# Altium schematic sheet TB6000.SchDoc
size A3
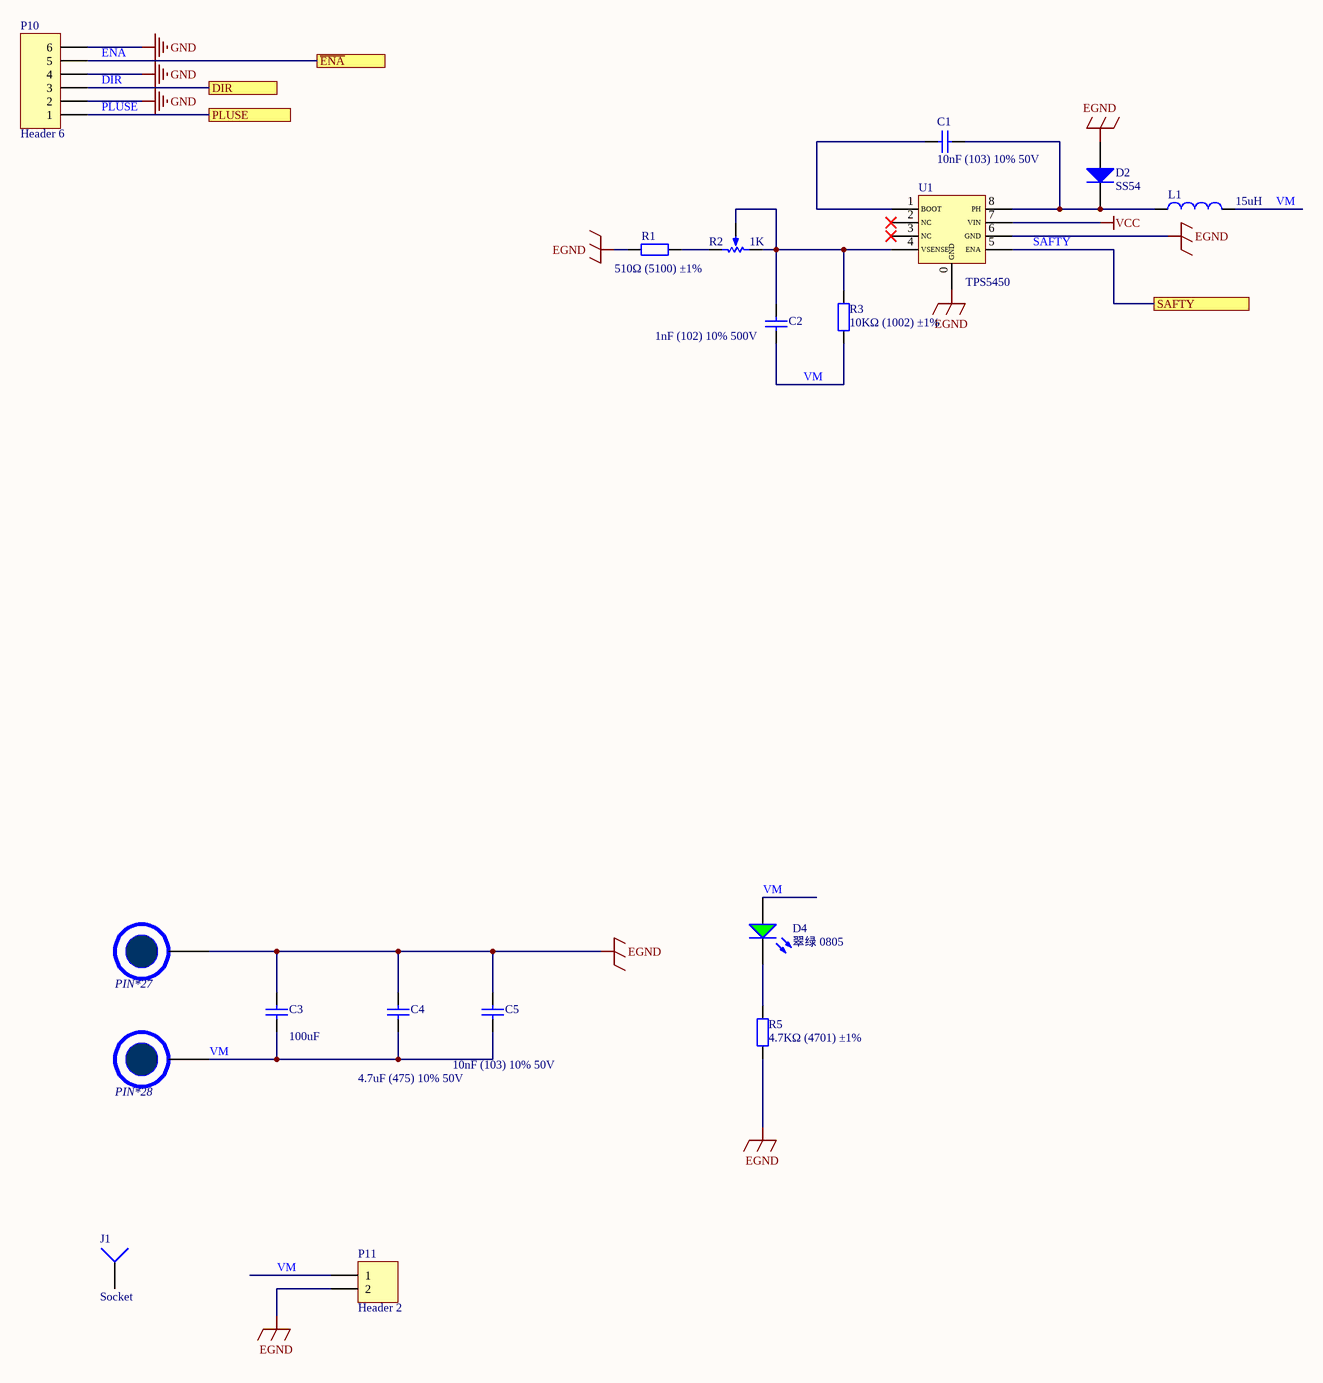
[diagram p0: TB6000.SchDoc]

## Parts
C1  10nF (103) 10% 50V  [1206_C]
C2  1nF (102) 10% 500V  [1206_C]
C3  value 100uF  [C100uF]  (hidden comment: Cap)
C4  4.7uF (475) 10% 50V  [1206_C]
C5  10nF (103) 10% 50V  [1206_C]
D2  SS54  [SMA(DO-214AC)_S1]
D4  翠绿 0805  [0805_LED_S1]
J1  Socket  [PCBComponent_1]
L1  value 15uH  [INDP175172X70M]  (hidden comment: Inductor)
P10  Header 6  [HDR1X6]
P11  Header 2  [HDR1X2]
PIN*27  PIN  [PIN]  (value not drawn)
PIN*28  PIN  [PIN]  (value not drawn)
R1  510Ω (5100) ±1%  [0805_R]
R2  value 1K  [RP1]  (hidden comment: RPot)
R3  10KΩ (1002) ±1%  [1206_R]
R5  4.7KΩ (4701) ±1%  [1206_R]
U1  TPS5450  [LC-SOP-8_EP_150mil]

## Ports
DIR, PLUSE, SAFTY, ~{ENA}

## Nets
EGND: C3.2 C4.2 C5.2 D2.1(A) P11.2 PIN*27.1(PIN) R1.1 R5.2 U1.0(GND) U1.6(GND)
GND: P10.2 P10.4 P10.6
VCC: U1.7(VIN)
DIR: P10.3 ; port DIR
~{ENA}: P10.5 ; port ~{ENA}
PLUSE: P10.1 ; port PLUSE
SAFTY: U1.5(ENA) ; port SAFTY
VM: C2.1 C3.1 C4.1 C5.1 D4.A L1.2 P11.1 PIN*28.1(PIN) R3.1
NetC1_1: C1.1 U1.1(BOOT)
NetC1_2: C1.2 D2.2(K) L1.1 U1.8(PH)
NetC2_2: C2.2 R2.2(TAP) R2.3(BOT) R3.2 U1.4(VSENSE)
NetD4_K: D4.K R5.1
NetR1_2: R1.2 R2.1(TOP)

Not connected (* = marked no-connect by the designer): J1 1; U1 2(NC)* 3(NC)*

## Library data of the parts
C1 C5 = 1206 10nF (103) 10% 50V: 贴片电容; ComponentLink1Description: 供应商链接; ComponentLink1URL: http://www.szlcsc.com/product/details_2198.html; Package: 1206; Supplier: LC; SuppliersPartNumber: C1846
C2 = 1206 1nF (102) 10% 500V: 贴片电容; ComponentLink1Description: 供应商链接; ComponentLink1URL: http://www.szlcsc.com/product/details_36187.html; Package: 1206; Supplier: LC; SuppliersPartNumber: C35216
C3 = Cap: 贴片电容; Published: 8-Jun-2000; LatestRevisionDate: 17-Jul-2002; LatestRevisionNote: Re-released for DXP Platform.; PackageReference: RAD-0.3; Publisher: Altium Limited
C4 = 1206 4.7uF (475) 10% 50V: 贴片电容; ComponentLink1Description: 供应商链接; ComponentLink1URL: http://www.szlcsc.com/product/details_30577.html; Package: 1206; Supplier: LC; SuppliersPartNumber: C29823
D2 = SMA(DO-214AC) SS54: 二极管; ComponentLink1Description: 供应商链接; ComponentLink1URL: http://www.szlcsc.com/product/details_23178.html; Package: SMA(DO-214AC); Supplier: LC; SuppliersPartNumber: C22452
D4 = 0805 翠绿: 发光二极管; ComponentLink1Description: 供应商链接; ComponentLink1URL: http://www.szlcsc.com/product/details_2670.html; Package: 0805; Supplier: LC; SuppliersPartNumber: C2297
L1 = Inductor: Code_IEC: 1005; Published: 8-Jun-2000; LatestRevisionDate: 29-May-2009; LatestRevisionNote: IPC-7351 Footprint Added.; PackageReference: 0402-A; Publisher: Altium Limited; PackageDescription: Chip Inductor; Code_JEITA: 0402
P10 = Header 6: Header, 6-Pin; LatestRevisionDate: 17-Jul-2002; LatestRevisionNote: Re-released for DXP Platform.; Publisher: Altium Limited
P11 = Header 2: Header, 2-Pin; LatestRevisionDate: 17-Jul-2002; LatestRevisionNote: Re-released for DXP Platform.; Publisher: Altium Limited
R1 = 0805 510Ω (5100) 1%: 贴片电阻; ComponentLink1Description: 供应商链接; ComponentLink1URL: http://www.szlcsc.com/product/details_18422.html; Package: 0805; Supplier: LC; SuppliersPartNumber: C17734
R2 = RPot: 电位器; Sim Note: Enter the Resistance value and the set point into parameter fields.; Set Position: 0.5; Published: 8-Jun-2000; LatestRevisionDate: 17-Jul-2002; LatestRevisionNote: Re-released for DXP Platform.; PackageReference: VR5; Publisher: Altium Limited
R3 = 1206 10KΩ (1002) 1%: 贴片电阻; ComponentLink1Description: 供应商链接; ComponentLink1URL: http://www.szlcsc.com/product/details_18590.html; Package: 1206; Supplier: LC; SuppliersPartNumber: C17902
R5 = 1206 4.7KΩ (4701) 1%: 贴片电阻; ComponentLink1Description: 供应商链接; ComponentLink1URL: http://www.szlcsc.com/product/details_18624.html; Package: 1206; Supplier: LC; SuppliersPartNumber: C17936
J1 = Socket: LatestRevisionDate: 17-Jul-2002; LatestRevisionNote: Re-released for DXP Platform.; Publisher: Altium Limited